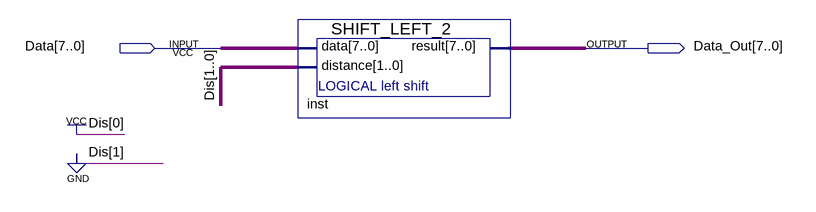
[diagram p0: schematic sheet]
// Quartus schematic Shift_Left_1.bdf as structural Verilog: 1 symbols, 2 pins
module Shift_Left_1 (
  input  [7:0] Data,
  output [7:0] Data_Out
);

  SHIFT_LEFT_2 inst (.data(Data), .distance(2'b01), .result(Data_Out));
endmodule
